# EAGLE schematic FM-Radio-Simple-Receiver-BB (EAGLE 7.2.0)
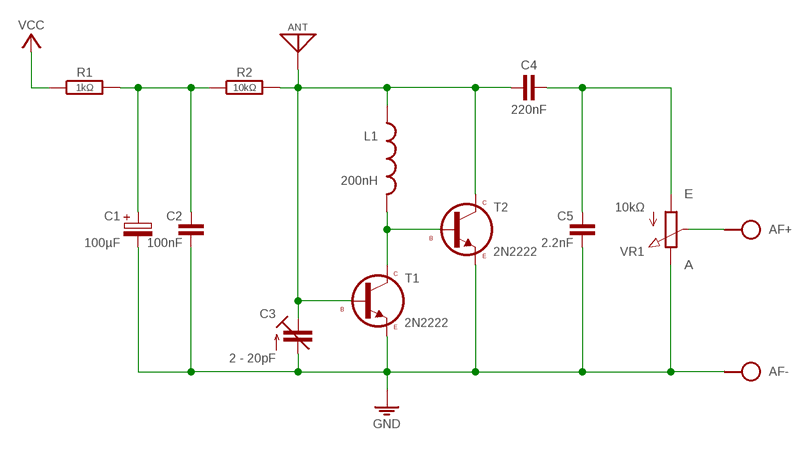
[diagram p0: schematic, sheet 1]

## Parts
AF  SPAD+-+-  [SPAD+-]
ANT  ANT  [SPAD]
BAT  VCC_GNDL  [SPAD-+]
C1  100µF  CPOLE2,5-5/V  [E2,5-5/V]
C2  100nF  C025-024X044  [C025-024X044]
C3  2 - 20pF  C-TR-PH201272222-808-2PIND  [TRIM-2222-808]
C4  220nF  C-H050-020X044  [C050-020X044]
C5  2.2nF  C050-020X036/V  [C050-020X036/V]
L1  200nH  L04/08  [L-04/8]
R1  1kΩ  R-H0202/7-V  [0202/7-V]
R2  10kΩ  R-H0204/10-V  [0204/10-V]
T1  2N2222  [TO92]
T2  2N2222  [TO92]
VR1  10kΩ  POT-3P  [CONN-3P]

## Nets
AF: C4.2 C5.1 VR1.1(A)
ANT: ANT.1 C3.3(E) C4.1 L1.1 R2.2 T1.2(B) T2.3(C)
GND: AF.1 BAT.1 C1.- C2.2 C3.2(A) C5.2 T1.1(E) T2.1(E) VR1.3(E)
HOT: L1.2 T1.3(C) T2.2(B)
OUT: AF.2 VR1.2(S)
SUP: C1.+ C2.1 R1.2 R2.1
VCC: BAT.2 R1.1

## Library data of the parts
AF = pad:SPAD+-
ANT = pad:ANT
BAT = pad:VCC_GND
C1 = c:CPOL: POLARIZED CAPACITOR, European symbol
C2 C5 = c:C: CAPACITOR, European symbol
C3 = cap-trim:C-TR-PH20127
C4 = c:C-H
L1 = l:L: Potentiometers Beckman, Copal, Piher, Spectrol, Schukat Created by librarian@cadsoft.de
R1 R2 = r:R-H
T1 T2 = t:2N2222
VR1 = r:POT